# EAGLE design WeighingControl_Karbra (EAGLE 9.6.2)
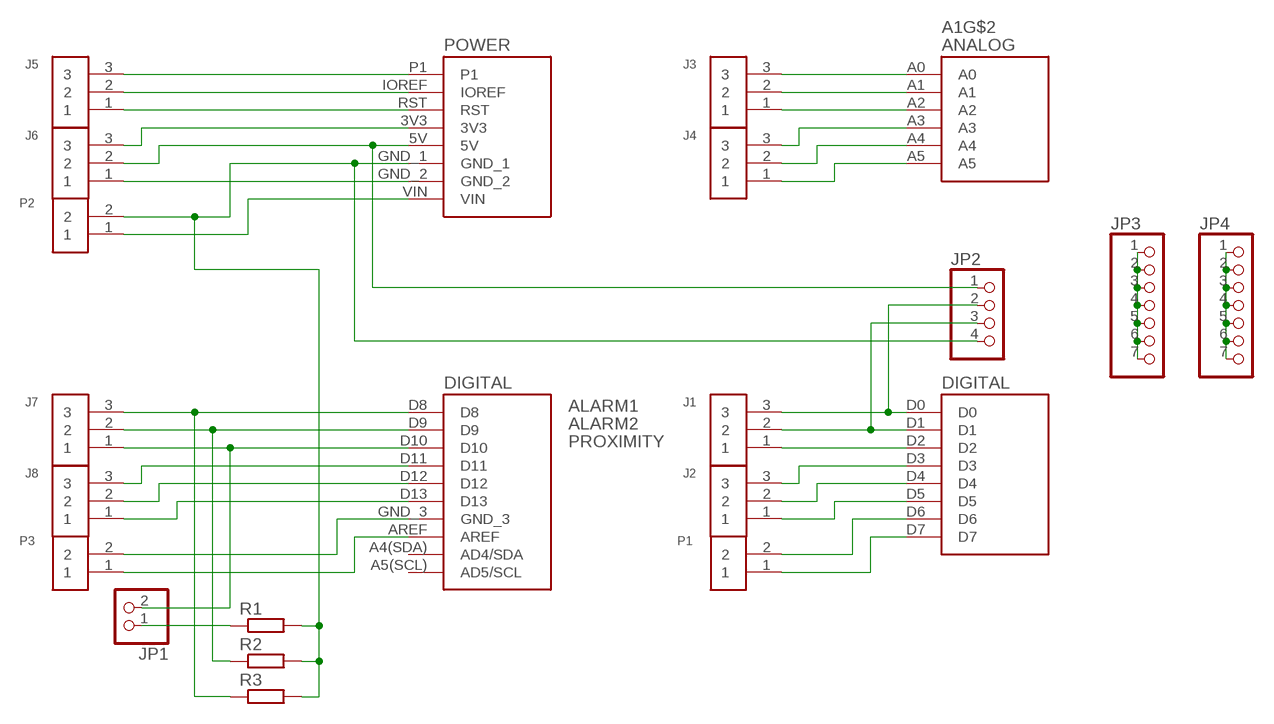
[diagram p0: schematic, sheet 1]

## Parts
A1  A000066  [ARDUINO_A000066]
J1  282837-3  [TE_282837-3]
J2  282837-3  [TE_282837-3]
J3  282837-3  [TE_282837-3]
J4  282837-3  [TE_282837-3]
J5  282837-3  [TE_282837-3]
J6  282837-3  [TE_282837-3]
J7  282837-3  [TE_282837-3]
J8  282837-3  [TE_282837-3]
JP1  PINHD-1X2  [1X02]
JP2  PINHD-1X4  [1X04]
JP3  PINHD-1X7  [1X07]
JP4  PINHD-1X7  [1X07]
P1  282837-2  [TE_282837-2]
P2  282837-2  [TE_282837-2]
P3  282837-2  [TE_282837-2]
R1  R-EU_0204/7  [0204/7]
R2  R-EU_0204/7  [0204/7]
R3  R-EU_0204/7  [0204/7]

## Nets
N$1: A1.A0 J3.3
N$2: A1.A1 J3.2
N$3: A1.A2 J3.1
N$4: A1.A3 J4.3
N$5: A1.A4 J4.2
N$6: A1.A5 J4.1
N$7: A1.D0 J1.3 JP2.2
N$8: A1.D1 J1.2 JP2.3
N$9: A1.D2 J1.1
N$10: A1.D3 J2.3
N$11: A1.D4 J2.2
N$12: A1.D5 J2.1
N$13: A1.D6 P1.2
N$14: A1.D7 P1.1
N$15: A1.P1 J5.3
N$16: A1.IOREF J5.2
N$17: A1.RST J5.1
N$18: A1.3V3 J6.3
N$19: A1.5V J6.2 JP2.1
N$20: A1.GND_1 JP2.4 P2.2 R1.2 R2.2 R3.2
N$21: A1.GND_2 J6.1
N$22: A1.VIN P2.1
N$23: A1.D8 J7.3 R3.1
N$24: A1.D9 J7.2 R2.1
N$25: JP1.1 R1.1
N$26: A1.D11 J8.3
N$27: A1.D12 J8.2
N$28: A1.D13 J8.1
N$29: A1.GND_3 P3.2
N$30: A1.AREF P3.1
N$31: JP3.1 JP3.2 JP3.3 JP3.4 JP3.5 JP3.6 JP3.7
N$32: JP4.1 JP4.2 JP4.3 JP4.4 JP4.5 JP4.6 JP4.7
N$34: A1.D10 J7.1 JP1.2
Unconnected: A1.A4(SDA)(AD4/SDA) A1.A5(SCL)(AD5/SCL)

## Notes on the sheet
- ALARM1
- ALARM2
- PROXIMITY

## Library data of the parts
A1 = A000066:A000066: Microcontroller board, Uno [Arduino] A000066 Microcontroller board, Uno 7640152110092; DESCRIPTION: A000066 | Arduino Uno Rev3 Arduino Corporation Embedded System Development Boards & Kits Microcontroller 16MHz - Arrow.com; DIGI-KEY_PART_NUMBER: 1050-1024-ND; MF: Arduino; MP: A000066; PACKAGE: Non-Standard Arduino; PURCHASE-URL: https://pricing.snapeda.com/search/part/A000066/?ref=eda
J1-J8 = 282837-3:282837-3: TERMI-BLOK PCB MOUNT 3P Check availability <https://pricing.snapeda.com/parts/282837-3/TE%20Connectivity/view-part?ref=eda>; AVAILABILITY: In Stock; COMMENT: 282837-3; DESCRIPTION: Wire to Board 3 Position 5.08 mm Pitch 30-16 AWG Euro Style Terminal Block; MF: TE Connectivity; MP: 282837-3; PACKAGE: None; PRICE: None; PURCHASE-URL: https://pricing.snapeda.com/search/part/282837-3/?ref=eda
JP1 = pinhead:PINHD-1X2: PIN HEADER
JP2 = pinhead:PINHD-1X4: PIN HEADER
JP3 JP4 = pinhead:PINHD-1X7: PIN HEADER
P1-P3 = 282837-2:282837-2: TERM BLOCK 5.08MM 2POS SIDE ENTY Check availability <https://pricing.snapeda.com/parts/282837-2/TE%20Connectivity/view-part?ref=eda>; AVAILABILITY: In Stock; COMMENT: 282837-2; DESCRIPTION: Connector Terminal Blocks Receptacle 2 Position 5.08mm Solder Straight Thru-Hole 13.5A/Contact; EU_ROHS_COMPLIANCE: Compliant with Exemptions; MF: TE Connectivity; MP: 282837-2; PACKAGE: None; PRICE: None; PURCHASE-URL: https://pricing.snapeda.com/search/part/282837-2/?ref=eda
R1-R3 = rcl:R-EU_: RESISTOR, European symbol; SPICEPREFIX: R

## Board
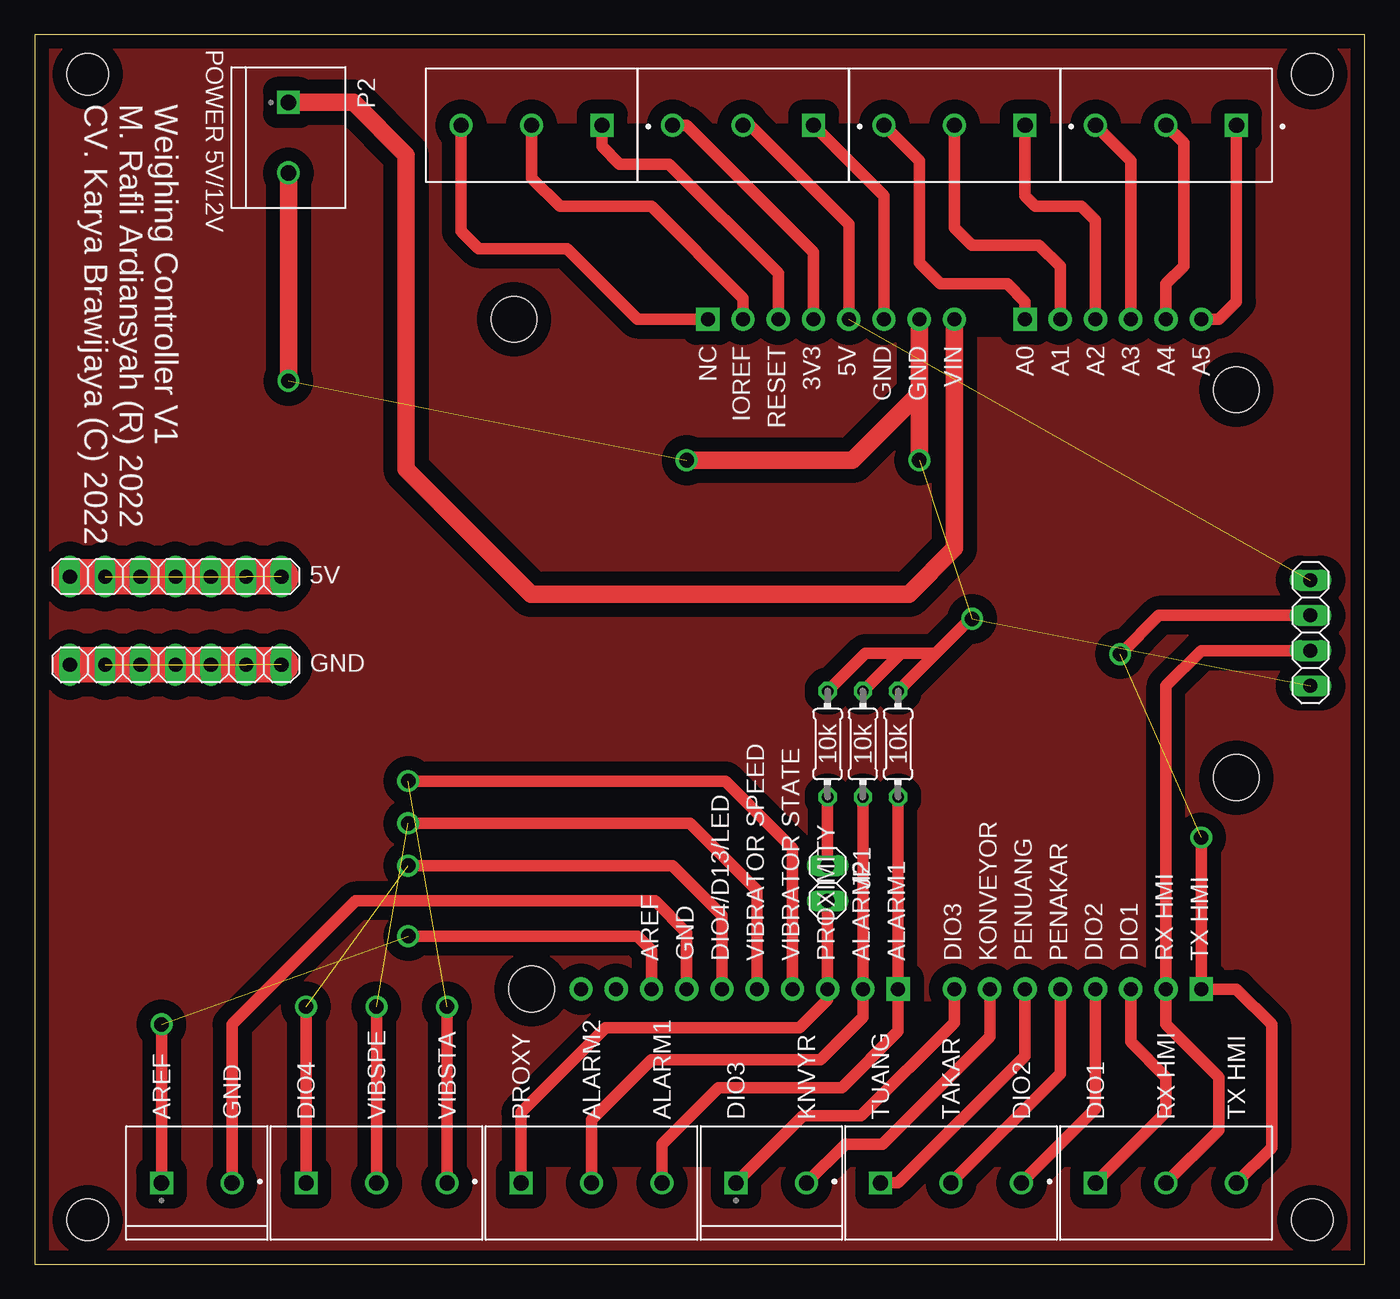
[diagram p1: board, top side]

Size 95.86 x 88.57 mm. Coordinates in mm from the lower left corner, seen from the top.
Outline: 0,0 95.86,0 95.86,88.57 0,88.57 0,0
Copper layers (1*16): Top 0.035mm / dielectric 1.5mm / Bottom 0.035mm
Design rules "default *": minimum track width 6mil, minimum drill 0.35mm, track to track 1mm, track to pad 0.7mm, pad to pad 0.7mm, via to via 0.7mm, smd to smd 0.7mm, copper to edge 40mil, drill to drill 6mil, minimum pad ring 10mil, minimum via ring 8mil, stop-mask expansion 4mil, vias tented up to drill 0mil, thermal gap 10mil
Holes 3 mm at 3.81,3.17 3.81,85.72 92.08,3.17 92.08,85.72

### Footprints (pad centres in the part's own frame; a part is rotated, then mirrored left to right if it is on the bottom)
ARDUINO_A000066 = drill 1.016 pad 1.676: 3V3 35.56,2.54; 5V 38.1,2.54; A1 53.34,2.54; A2 55.88,2.54; A3 58.42,2.54; A4 60.96,2.54; A4(SDA) 21.336,50.8; A5 63.5,2.54; A5(SCL) 18.796,50.8; AREF 23.876,50.8; D1 60.96,50.8; D2 58.42,50.8; D3 55.88,50.8; D4 53.34,50.8; D5 50.8,50.8; D6 48.26,50.8; D7 45.72,50.8; D9 39.116,50.8; D10 36.576,50.8; D11 34.036,50.8; D12 31.496,50.8; D13 28.956,50.8; GND_1 43.18,2.54; GND_2 40.64,2.54; GND_3 26.416,50.8; IOREF 30.48,2.54; RST 33.02,2.54; VIN 45.72,2.54 | drill 1.016 pad 1.676 square: A0 50.8,2.54; D0 63.5,50.8; D8 41.656,50.8; P1 27.94,2.54 | hole 3.3: 66.04,35.56; 66.04,7.62; 15.24,50.8; 13.97,2.54
TE_282837-3 = drill 1.1 square: 1 -5.08,0 | drill 1.1: 2 0,0; 3 5.08,0
1X02 = drill 1.016 long: 1 -1.27,0; 2 1.27,0
1X04 = drill 1.016 long: 1 -3.81,0; 2 -1.27,0; 3 1.27,0; 4 3.81,0
1X07 = drill 1.016 long: 1 -7.62,0; 2 -5.08,0; 3 -2.54,0; 4 0,0; 5 2.54,0; 6 5.08,0; 7 7.62,0
TE_282837-2 = drill 1.1 square: 1 -2.54,0 | drill 1.1: 2 2.54,0
0204/7 = drill 0.813 octagon: 1 -3.81,0; 2 3.81,0

### Placement (x,y rotation side)
A1  20.57,70.61 180 bottom
J1  81.53,5.84 0 top
J2  66.04,5.84 0 top
J3  66.29,82.04 180 top
J4  81.53,82.04 180 top
J5  35.81,82.04 180 top
J6  51.05,82.04 180 top
J7  40.13,5.84 0 top
J8  24.64,5.84 0 top
JP1  57.15,27.43 270 top
JP2  91.95,45.47 270 top
JP3  10.16,49.53 0 top
JP4  10.16,43.18 0 top
P1  53.09,5.84 0 top
P2  18.29,81.15 270 top
P3  11.68,5.84 0 top
R1  57.15,37.47 90 top
R2  59.69,37.47 90 top
R3  62.23,37.47 90 top

### Tracks (layer width: path | path; a pad name or v marks a point on that pad's centre or on a via)
KEEP0
  cutout Top: 26.92,34.67 49.91,34.67 54.61,29.97 54.61,23.11 54.48,22.99 26.92,22.99
KEEP1
  cutout Top: 35.05,7.11 87.25,7.11 89.03,8.89 89.03,17.02 87.25,18.8 42.8,18.8 36.32,12.32 35.05,11.05
KEEP2
  cutout Top: 86.61,82.04 30.73,82.04 30.73,74.55 32.13,73.15 38.23,73.15 44.45,66.93 83.06,66.93 83.06,66.93 86.61,70.48
MASKING_ATAS
  pour Top (isolate 1): 0,88.52 95.89,88.52 95.89,87.25 95.89,0 93.73,0 0,0 0,2.16
N$1
  Top 0.813: J3.3 63.75,79.5 63.75,72.14 65.28,70.61 70.1,70.61 71.37,69.34 A1.A0
N$2
  Top 0.813: J3.2 66.29,74.68 67.56,73.41 72.39,73.41 73.91,71.88 A1.A1
N$3
  Top 0.61: A1.A2 76.45,74.42
  Top 0.813: J3.1 71.37,76.96 72.14,76.2 75.44,76.2 76.45,75.18 A1.A2
N$4
  Top 0.813: J4.3 78.99,79.5 A1.A3
N$5
  Top 0.813: J4.2 82.8,80.77 82.8,71.88 81.53,70.61 A1.A4
N$6
  Top 0.813: A1.A5 85.34,68.07 86.61,69.34 J4.1
N$7  (via drill 1.05 pad 0.75)  (1 unrouted)
  Top 0.813: J1.3 89.15,8.38 89.15,17.27 86.61,19.81 A1.D0 v84.07,30.73 | JP2.2 81.03,46.74 v78.23,43.94
N$8
  Top 0.813: J1.2 85.34,9.65 85.34,13.46 81.53,17.27 A1.D1 81.53,41.66 84.07,44.2 JP2.3
N$9
  Top 0.813: J1.1 81.53,10.92 81.53,13.46 78.99,16 A1.D2
N$10
  Top 0.813: J2.3 76.45,11.18 A1.D3
N$11
  Top 0.813: A1.D4 73.91,13.72 J2.2
N$12
  Top 0.813: A1.D5 71.37,14.99 62.23,5.84 J2.1
N$13
  Top 0.813: P1.2 58.42,8.64 61.09,8.64 68.83,16.38 A1.D6
N$14
  Top 0.813: P1.1 55.37,10.67 59.56,10.67 66.29,17.4 A1.D7
N$15
  Top 0.813: J5.3 30.73,74.42 32,73.15 38.35,73.15 43.43,68.07 A1.P1
N$16
  Top 0.813: J5.2 35.81,78.23 37.85,76.2 44.45,76.2 51.05,69.6 A1.IOREF
N$17
  Top 0.813: J5.1 40.89,80.52 42.16,79.25 45.72,79.25 53.59,71.37 A1.RST
N$18
  Top 0.813: J6.3 46.99,82.04 56.13,72.9 A1.3V3
N$19  (1 unrouted)
  Top 0.813: J6.2 51.56,82.04 58.67,74.93 A1.5V
N$20  (via drill 1.05 pad 0.75)  (3 unrouted)
  Top 0.813: R3.2 64.96,44.01 | 64.96,44.01 67.44,46.48 v67.56,46.48 | 62.42,44.01 59.88,44.01 R1.2 | 62.42,44.01 64.96,44.01 | R2.2 62.42,44.01
  Top 1.27: A1.GND_1 63.75,62.74 | 63.75,62.74 v63.75,57.91 | 63.75,62.74 58.93,57.91 v46.99,57.91 | v18.29,63.63 P2.2
N$21
  Top 0.813: J6.1 61.21,76.96 A1.GND_2
N$22
  Top 1.27: A1.VIN 66.29,51.56 62.99,48.26 35.79,48.26 26.78,57.26 26.78,79.9 22.99,83.69 P2.1
N$23
  Top 0.813: R3.1 A1.D8 62.23,16.76 58.17,12.7 49.28,12.7 45.21,8.64 J7.3
N$24
  Top 0.813: R2.1 A1.D9 59.69,17.78 56.64,14.73 44.45,14.73 40.13,10.41 J7.2
N$25
  Top 0.813: JP1.1 R1.1
N$26  (via drill 1.05 pad 0.75)  (1 unrouted)
  Top 0.813: v29.72,18.54 J8.3 | A1.D11 54.61,29.97 49.78,34.8 v26.92,34.8
N$27  (via drill 1.05 pad 0.75)  (1 unrouted)
  Top 0.813: v24.64,18.54 J8.2 | A1.D12 52.07,26.92 47.24,31.75 v26.92,31.75
N$28  (via drill 1.05 pad 0.75)  (1 unrouted)
  Top 0.813: A1.D13 49.53,25.15 45.97,28.7 v26.92,28.7 | v19.56,18.54 J8.1
N$29
  Top 0.813: A1.GND_3 46.99,23.88 44.7,26.16 23.11,26.16 14.22,17.27 P3.2
N$30  (via drill 1.05 pad 0.75)  (1 unrouted)
  Top 0.813: A1.AREF 44.45,22.61 43.43,23.62 v26.92,23.62 | v9.14,17.27 P3.1
N$31  (5 unrouted)
  Top 2.54: JP3.1 JP3.7
N$32  (5 unrouted)
  Top 2.54: JP4.1 JP4.7
N$34
  Top 0.813: J7.1 35.05,10.92 41.15,17.02 55.12,17.02 57.15,19.05 A1.D10 JP1.2

### Text on the board
tNames: POWER 5V/12V | CV. Karya Brawijaya (C) 2022 | M. Rafli Ardiansyah (R) 2022 | Weighing Controller V1 | NC | IOREF | RESET | 3V3 | 5V | GND | GND | VIN | A0 | A1 | A2 | A3 | A4 | A5 | 5V | GND | 10k | 10k | 10k | AREF | GND | DIO4/D13/LED | VIBRATOR SPEED | VIBRATOR STATE | PROXIMITY | ALARM2 | ALARM1 | DIO3 | KONVEYOR | PENUANG | PENAKAR | DIO2 | DIO1 | RX HMI | TX HMI | AREF | GND | DIO4 | VIBSPE | VIBSTA | PROXY | ALARM2 | ALARM1 | DIO3 | KNVYR | TUANG | TAKAR | DIO2 | DIO1 | RX HMI | TX HMI